# Altium schematic sheet BFMC_Actuators.SchDoc
size A; SheetNumber: 7; SheetTotal: 7
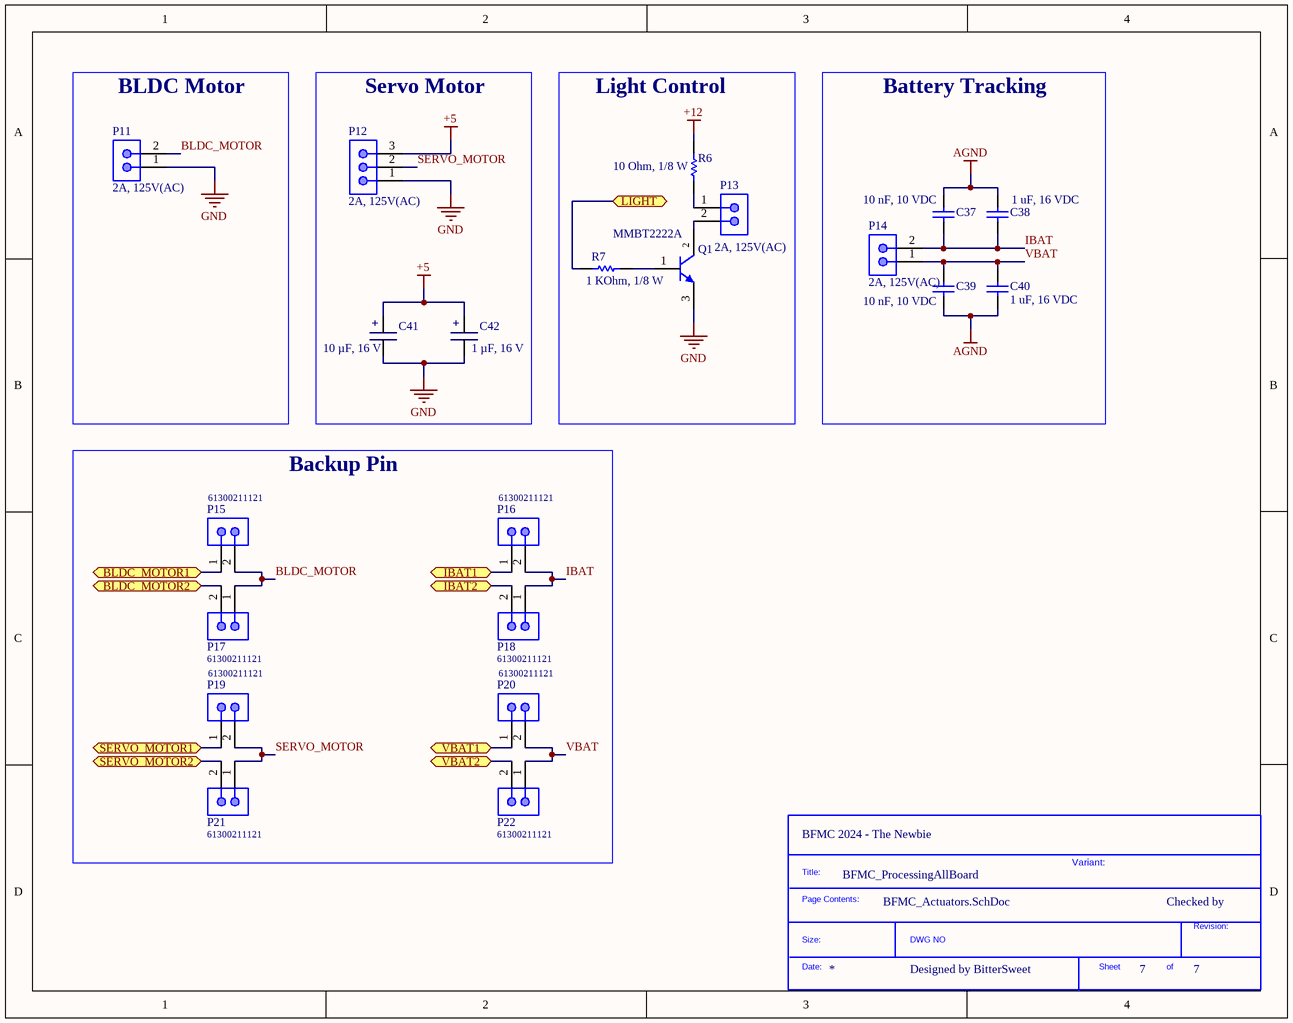
[diagram p0: BFMC_Actuators.SchDoc]

## Parts
*?  SDTitleBlock  (value not drawn)  (graphical)
C37  10 nF, 10 VDC  [CAP_0603]
C38  1 uF, 16 VDC  [CAP_0603]
C39  10 nF, 10 VDC  [CAP_0603]
C40  1 uF, 16 VDC  [CAP_0603]
C41  10 µF, 16 V  [TANTALUM SMD A]
C42  1 µF, 16 V  [TANTALUM SMD A]
P11  2A, 125V(AC)  [620102131822]
P12  2A, 125V(AC)  [620103131822]
P13  2A, 125V(AC)  [620302124022]
P14  2A, 125V(AC)  [620102131822]
P15  61300211121  [61300211121]
P16  61300211121  [61300211121]
P17  61300211121  [61300211121]
P18  61300211121  [61300211121]
P19  61300211121  [61300211121]
P20  61300211121  [61300211121]
P21  61300211121  [61300211121]
P22  61300211121  [61300211121]
Q1  MMBT2222A  [MMBT-SOT23]
R6  10 Ohm, 1/8 W  [RESISTOR_0805]
R7  1 KOhm, 1/8 W  [RESISTOR_0805]

## Blocks framed on the sheet
BLDC Motor: P11
Servo Motor: C41 C42 P12
Light Control: P13 Q1 R6 R7
Battery Tracking: C37-C40 P14
Backup Pin: P15-P22

## Ports
BLDC_MOTOR1 (bidir), BLDC_MOTOR2 (bidir), IBAT1 (bidir), IBAT2 (bidir), LIGHT (bidir), SERVO_MOTOR1 (bidir), SERVO_MOTOR2 (bidir), VBAT1 (bidir), VBAT2 (bidir)

## Nets
+5: C41.2 C42.2 P12.3
+12: R6.2
AGND: C37.2 C38.2 C39.1 C40.1
GND: C41.1 C42.1 P11.1 P12.1 Q1.3(E)
BLDC_MOTOR: P11.2 P15.2 P17.1
BLDC_MOTOR1: P15.1 ; port BLDC_MOTOR1
BLDC_MOTOR2: P17.2 ; port BLDC_MOTOR2
IBAT: C37.1 C38.1 P14.2 P16.2 P18.1
IBAT1: P16.1 ; port IBAT1
IBAT2: P18.2 ; port IBAT2
LIGHT: R7.1 ; port LIGHT
SERVO_MOTOR: P12.2 P19.2 P21.1
SERVO_MOTOR1: P19.1 ; port SERVO_MOTOR1
SERVO_MOTOR2: P21.2 ; port SERVO_MOTOR2
VBAT: C39.2 C40.2 P14.1 P20.2 P22.1
VBAT1: P20.1 ; port VBAT1
VBAT2: P22.2 ; port VBAT2
NetP13_1: P13.1 R6.1
NetP13_2: P13.2 Q1.2(C)
NetQ1_1: Q1.1(B) R7.2

## Notes on the sheet
- (near *?) BFMC 2024 - The Newbie
- BFMC_ProcessingAllBoard
- Variant:
- Checked by
- Designed by BitterSweet
- (in symbol 01120610510) +
- (in symbol 01120610610) +
- (in symbol SDTitleBlock) Title:; Page Contents:; Revision:; Size:; DWG NO; Date:; Sheet; of

## Library data of the parts
C37 C39 = 0106031061010: CAP, size 0603, 10 nF, 10 VDC; Manufacture Name: Samsung Electro-Mechanics; Manufacture SN: CL10A106KP8NNWC; Capacitance: 10 nF; Tolerance: +/-10%; Voltage Rating DC: 10 VDC; ComponentLink2Description: Datasheet; ComponentLink2URL: https://www.mouser.vn/datasheet/2/585/MLCC-1837944.pdf; Operating Temperature: -55 to +125degC; Packaging: Tape and Reel; Mounting Technology: SMT; Size: 0603; Supplier 1 Name: Mouser; Supplier 1 SN: 187-CL10A106KP8NNWC; Supplier 1 URL: https://www.mouser.vn/ProductDetail/Samsung-Electro-Mechanics/CL10A106KP8NNWC?qs=xZ%2FP%252Ba9zWqZx8LSX23YqWA%3D%3D&utm_source=mouser-refine-download&utm_medium=file&utm_campaign=CL10A106KP8NNWC&utm_content=Samsung-Electro-Mechanics; Supplier 2 Name: Digi-Key; Supplier 2 SN: 1276-CL10A106KP8NNWCTR-ND; Supplier 2 URL: https://www.digikey.com/en/products/detail/samsung-electro-mechanics/cl10a106kp8nnwc/16572907; Supplier 3 Name: thegioiic; Supplier 3 SN: N/A; Supplier 3 URL: https://www.thegioiic.com/tu-gom-0603-10uf-25v; Value: 10 nF, 10 VDC; ComponentLink3Description: JLCPCB Link; ComponentLink3URL: https://jlcpcb.com/partdetail/Walsin_TechCorp-0603X106K100/C90806; JLCPCB Part: C90806
C38 C40 = 0106031051016: CAP, size 0603, 1 uF, 16 VDC; Manufacture Name: Samsung Electro-Mechanics; Manufacture SN: CL10B105KO8NNWC; Capacitance: 1 uF; Tolerance: +/-10%; Voltage Rating DC: 16 VDC; ComponentLink2Description: Datasheet; ComponentLink2URL: https://www.mouser.vn/datasheet/2/585/Samsung_MLCC_1837944-1929650.pdf; Operating Temperature: -55 to +125degC; Packaging: Tape and Reel; Mounting Technology: SMT; Size: 0603; Supplier 1 Name: Mouser; Supplier 1 SN: 187-CL10B105KO8NNWC; Supplier 1 URL: https://www.mouser.vn/ProductDetail/Samsung-Electro-Mechanics/CL10B105KO8NNWC?qs=81r%252BiQLm7BT%252BXtc72qn1ug%3D%3D&utm_source=mouser-refine-download&utm_medium=file&utm_campaign=CL10B105KO8NNWC&utm_content=Samsung-Electro-Mechanics; Supplier 2 Name: Digi-Key; Supplier 2 SN: 1276-CL10B105KO8NNWCTR-ND; Supplier 2 URL: https://www.digikey.com/en/products/detail/samsung-electro-mechanics/cl10b105ko8nnwc/16572783; Supplier 3 Name: thegioiic; Supplier 3 SN: N/A; Supplier 3 URL: https://www.thegioiic.com/tu-gom-0603-1uf-16v; Value: 1 uF, 16 VDC
C41 = 01120610610: CAP TANT 10uF 10% 16V 1206; Manufacture  Name: KYOCERA AVX; Manufacture  SN: TPSA106K016R1000; Capacitance Tolerance: +/-10%; ComponentLink1Description: Datasheet link; ComponentLink1URL: https://datasheets.kyocera-avx.com/TAJ.pdf; ComponentLink2Description: Supplier 1 URL; ComponentLink2URL: https://www.mouser.vn/ProductDetail/KYOCERA-AVX/TPSA106K016R1000?qs=GLv2FRWg8zkKT7IxHlCjvQ%3D%3D; Size: 1206; Mounting Technology: SMT; Capacitance: 10uF; ComponentLink3Description: Supplier 2 URL; ComponentLink3URL: https://www.digikey.com/en/products/detail/kyocera-avx/TPSA106K016R1000/7536120; ComponentLink4Description: Supplier 3 URL; ComponentLink4URL: https://www.thegioiic.com/tu-tantalum-10uf-16v-1206-taja106k016rnj; Supplier 1 Name: Mouser; Supplier 1 SN: 581-TPSA106K016R1000; Supplier 1 URL: https://www.mouser.vn/ProductDetail/KYOCERA-AVX/TPSA106K016R1000?qs=GLv2FRWg8zkKT7IxHlCjvQ%3D%3D; Supplier 2 Name: Digi-Key; Supplier 2 SN: 478-10757-1-ND; Supplier 2 URL: https://www.digikey.com/en/products/detail/kyocera-avx/TPSA106K016R1000/7536120; Supplier 3 Name: thegioiic; Supplier 3 SN: N/A; Supplier 3 URL: https://www.thegioiic.com/tu-tantalum-10uf-16v-1206-taja106k016rnj; Value: 10 µF, 16 V; Rated Voltage: 16 V
C42 = 01120610510: CAP TANT 1uF 10% 16V 1206; Manufacture  Name: KYOCERA AVX; Manufacture  SN: TAJA105K016RNJ; Capacitance Tolerance: +/-10%; ComponentLink1Description: Datasheet link; ComponentLink1URL: https://datasheets.kyocera-avx.com/TAJ.pdf; ComponentLink2Description: Supplier 1 URL; ComponentLink2URL: https://www.mouser.vn/ProductDetail/KYOCERA-AVX/TAJA105K016RNJ?qs=OVpPYgiJXXWzOIbDvQCr4Q%3D%3D; Size: 1206; Mounting Technology: SMT; Capacitance: 1uF; ComponentLink3Description: Supplier 2 URL; ComponentLink3URL: https://www.digikey.com/en/products/detail/kyocera-avx/TAJA105K016RNJ/563757; ComponentLink4Description: Supplier 3 URL; ComponentLink4URL: https://www.thegioiic.com/tu-tantalum-1uf-16v-1206-taja105k016rnj; Supplier 1 Name: Mouser; Supplier 1 SN: 581-TAJA105K016; Supplier 1 URL: https://www.mouser.vn/ProductDetail/KYOCERA-AVX/TAJA105K016RNJ?qs=OVpPYgiJXXWzOIbDvQCr4Q%3D%3D; Supplier 2 Name: Digi-Key; Supplier 2 SN: 478-1649-1-ND; Supplier 2 URL: https://www.digikey.com/en/products/detail/kyocera-avx/TAJA105K016RNJ/563757; Supplier 3 Name: thegioiic; Supplier 3 SN: N/A; Supplier 3 URL: https://www.thegioiic.com/tu-tantalum-1uf-16v-1206-taja105k016rnj; Value: 1 µF, 16 V; Rated Voltage: 16 V
P11 P14 = 620102131822: WR-WTB SMT Male Horizontal Shrouded Header, pitch 2mm, 2p; Pin Number: 2; Contact Resistance: 20mOhm; Withstanding Voltage: 800VAC; Working Voltage: 100VAC; ComponentLink1Description: Manufacturer; ComponentLink1URL: http://www.we-online.de; ComponentLink2Description: Datasheet; ComponentLink2URL: https://www.we-online.com/catalog/datasheet/620102131822.pdf; Pitch: 2mm; Published Date: January 2020; Publisher: Wurth Elektronik; Mounting Technology: SMT; Packaging: Tape and Reel; Operating Temperature: -25 to +85degC; Part Number: 620102131822; Gender: Male; Type: Horizontal; Rated Current: 2A; ComponentLink3Description: Global Supply; ComponentLink3URL: https://www.we-online.com/en/components/products/WTB_2_00_SMT_MALE_HORIZONTAL_SHROUDED_HEADER_6201XX131822?sq=620102131822#620102131822; ComponentLink4Description: Global Supply; ComponentLink4URL: https://www.mouser.vn/ProductDetail/Wurth-Elektronik/620102131822?qs=ZtY9WdtwX54K2dkLvxjzuQ%3D%3D; Supplier 1 Name: Mouser; Supplier 1 SN: 710-620102131822; Supplier 1 URL: https://www.mouser.vn/ProductDetail/Wurth-Elektronik/620102131822?qs=ZtY9WdtwX54K2dkLvxjzuQ%3D%3D; Supplier 2 Name: Digi-Key; Supplier 2 SN: N/A; Supplier 2 URL: N/A; Supplier 3 Name: thegioiic; Supplier 3 SN: N/A; Supplier 3 URL: https://www.thegioiic.com/dau-ph2-0mm-2-chan-dan-smd-nam-ngang; Value: 2A, 125V(AC)
P12 = 620103131822: WR-WTB SMT Male Horizontal Shrouded Header, pitch 2mm, 3p; Pin Number: 3; Contact Resistance: 20mOhm; Withstanding Voltage: 800VAC; Working Voltage: 100VAC; ComponentLink1Description: Manufacturer; ComponentLink1URL: http://www.we-online.de; ComponentLink2Description: Datasheet; ComponentLink2URL: https://www.we-online.com/catalog/datasheet/620103131822.pdf; Pitch: 2mm; Published Date: January 2020; Publisher: Wurth Elektronik; Mounting Technology: SMT; Packaging: Tape and Reel; Operating Temperature: -25 to +85degC; Part Number: 620103131822; Gender: Male; Type: Horizontal; Rated Current: 2A; ComponentLink3Description: Global Supply; ComponentLink3URL: https://www.we-online.com/en/components/products/WTB_2_00_SMT_MALE_HORIZONTAL_SHROUDED_HEADER_6201XX131822?sq=620103131822#620103131822; ComponentLink4Description: Global Supply; ComponentLink4URL: https://www.mouser.vn/ProductDetail/Wurth-Elektronik/620103131822?qs=ZtY9WdtwX54jBicvPVEzcw%3D%3D; Supplier 1 Name: Mouser; Supplier 1 SN: 710-620103131822; Supplier 1 URL: https://www.mouser.vn/ProductDetail/Wurth-Elektronik/620103131822?qs=ZtY9WdtwX54jBicvPVEzcw%3D%3D; Supplier 2 Name: Digi-Key; Supplier 2 SN: N/A; Supplier 3 Name: thegioiic; Supplier 3 SN: N/A; Supplier 3 URL: https://www.thegioiic.com/dau-ph2-0mm-3-chan-dan-smd-nam-ngang; Value: 2A, 125V(AC)
P13 = 620302124022: WR-WTB SMT Male Vertical Shrouded Header, pitch 2mm, 2p; Pin Number: 2; Contact Resistance: 20mOhm; Withstanding Voltage: 800VAC; Working Voltage: 100VAC; ComponentLink1Description: Manufacturer; ComponentLink1URL: http://www.we-online.de; ComponentLink2Description: Datasheet; ComponentLink2URL: https://www.we-online.com/catalog/datasheet/620302124022.pdf; Pitch: 2mm; Published Date: January 2020; Publisher: Wurth Elektronik; Mounting Technology: SMT; Packaging: Tape and Reel; Operating Temperature: -25 to +85degC; Part Number: 620302124022; Gender: Male; Type: Vertical; Rated Current: 2A; ComponentLink3Description: Global Supply; ComponentLink3URL: https://www.we-online.com/en/components/products/WTB_2_00_SMT_MALE_VERTICAL_SHROUDED_HEADER_6203XX124022?sq=620302124022#620302124022; ComponentLink4Description: Global Supply; ComponentLink4URL: https://www.mouser.vn/ProductDetail/Wurth-Elektronik/620302124022?qs=ZtY9WdtwX56bKCHoSxh6%252Bg%3D%3D; Supplier 1 Name: Mouser; Supplier 1 SN: 710-620302124022; Supplier 1 URL: https://www.mouser.vn/ProductDetail/Wurth-Elektronik/620302124022?qs=ZtY9WdtwX56bKCHoSxh6%252Bg%3D%3D; Supplier 2 Name: Digi-Key; Supplier 2 SN: N/A; Supplier 2 URL: N/A; Supplier 3 Name: thegioiic; Supplier 3 SN: N/A; Supplier 3 URL: https://www.thegioiic.com/dau-hy2-0mm-2-chan-dan-smd-thang-dung; Value: 2A, 125V(AC)
P15-P22 = 61300211121: WR-PHD Pin Header, THT, pitch 2.54mm, Single Row, Vertical, 2p; Manufacturer: Wurth Elektronik; Pin Number: 2; Rated Current: 3A; Working Voltage: 250VAC; Withstanding Voltage: 500VAC; Contact Resistance: 20mOhm; Supply Name 1: Mouser; ComponentLink1Description: Manufacturer; ComponentLink1URL: http://www.we-online.de; ComponentLink2Description: Datasheet; ComponentLink2URL: https://www.we-online.com/catalog/datasheet/61300211121.pdf; Manufacturer Part Number: 61300211121; Published Date: May 2020; Pitch: 2.54mm; Operating Temperature: -40 to +105degC; Mounting Technology: THT; Packaging: Bag; Gender: Pin Header; Row Number: Single; Orientation: Vertical; ComponentLink3Description: Global Supply; ComponentLink3URL: https://www.mouser.vn/ProductDetail/Wurth-Elektronik/61300211121?qs=t4813l51qx%252B1A5GYDQxPlw%3D%3D; Supplier 1 Name: Mouser; Supplier 1 SN: 710-61300211121; Supplier 1 URL: https://www.mouser.vn/ProductDetail/Wurth-Elektronik/61300211121?qs=t4813l51qx%252B1A5GYDQxPlw%3D%3D; Supplier 2 Name: Digi-Key; Supplier 2 SN: N/A; Supplier 2 URL: N/A; Supplier 3 Name: thegioiic; Supplier 3 SN: N/A; Supplier 3 URL: N/A
Q1 = MMBT2222A: TRANS NPN, 40V, 600MA, SOT23-3; DC Current Gain: 35-300; Gain Bandwidth Product fT: 250MHz; Power Dissipation: 250mW; Current - Collector: 600mA; Package: SOT-23; Supplier 1 Name: Mouser; Supplier 1 SN: 637-MMBT2222A; Supplier 1 URL: https://www.mouser.vn/ProductDetail/Diotec-Semiconductor/MMBT2222A?qs=OlC7AqGiEDl9N1c3%252BL%2F%252Brw%3D%3D; Supplier 2 Name: Digi-Key; Supplier 2 SN: 2796-MMBT2222ATR-ND; Supplier 2 URL: https://www.digikey.com/en/products/detail/diotec-semiconductor/MMBT2222A/13163394; Supplier 3 Name: thegioiic; Supplier 3 URL: https://www.thegioiic.com/mmbt2222a-transistor-npn-40v-0-6a-3-chan-sot-23; Transistor Type: NPN; Voltage - Collector Emitter Breakdown: 40V; Supplier 3 SN: N/A; Value: MMBT2222A
R6 = 0008051001: RES, size 0805, 10 Ohm, 1/8 W; Manufacture  Name: Vishay Dale Thin Film; Manufacture  SN: M55342H06B10D0RT5; Resistance tolerance: +/-1%; Rated Power: 1/8 W; Resistance: 10 Ohm; Size: 0805; Mounting Technology: SMT; Supplier 1 Name: Mouser; Supplier 1 SN: 71-CRCW080510R0FKEAH; Supplier 1 URL: https://www.mouser.vn/ProductDetail/Vishay-Dale/CRCW080510R0FKEAHP?qs=sGAEpiMZZMtlubZbdhIBIB2QTI7Ai3Wq221SUXRDybo%3D; Supplier 2 Name: Digi-Key; Supplier 2 SN: 764-M55342H06B10D0RT5TR-ND; Supplier 2 URL: https://www.digikey.com/en/products/detail/vishay-dale-thin-film/M55342H06B10D0RT5/3580812; Supplier 3 Name: Thegioiic; Supplier 3 SN: N/A; Supplier 3 URL: https://www.thegioiic.com/dien-tro-10-ohm-0805-1-; Value: 10 Ohm, 1/8 W; ComponentLink1Description: Datasheet link; ComponentLink1URL: https://www.vishay.com/docs/60018/eh.pdf; ComponentLink2Description: Supplier 1 URL; ComponentLink2URL: https://www.mouser.vn/ProductDetail/Vishay-Dale/CRCW080510R0FKEAHP?qs=sGAEpiMZZMtlubZbdhIBIB2QTI7Ai3Wq221SUXRDybo%3D; ComponentLink3Description: Supplier 2 URL; ComponentLink3URL: https://www.digikey.com/en/products/detail/vishay-dale-thin-film/M55342H06B10D0RT5/3580812; ComponentLink4Description: Supplier 3 URL; ComponentLink4URL: https://www.thegioiic.com/dien-tro-10-ohm-0805-1-
R7 = 0008051025: RES, size 0805, 1 KOhm, 1/8 W; Manufacture  Name: Vishay Dale; Manufacture  SN: CRCW08051K00JNEAC; Resistance tolerance: +/-5%; Rated Power: 1/8 W; Resistance: 1 KOhm; Size: 0805; Mounting Technology: SMT; Supplier 1 Name: Mouser; Supplier 1 SN: 71-CRCW08051K00JNEC; Supplier 1 URL: https://www.mouser.vn/ProductDetail/Vishay-Dale/CRCW08051K00JNEC?qs=OW6ROCK%252BaiZqKFsNe9zjFw%3D%3D; Supplier 2 Name: Digi-Key; Supplier 2 SN: 541-4162-2-ND; Supplier 2 URL: https://www.digikey.com/en/products/detail/vishay-dale/CRCW08051K00JNEAC/7928584; Supplier 3 Name: Thegioiic; Supplier 3 SN: N/A; Supplier 3 URL: https://www.thegioiic.com/dien-tro-1-kohm-0805-5-; Value: 1 KOhm, 1/8 W; ComponentLink1Description: Datasheet link; ComponentLink1URL: https://www.vishay.com/docs/28773/crcwce3.pdf; ComponentLink2Description: Supplier 1 URL; ComponentLink2URL: https://www.mouser.vn/ProductDetail/Vishay-Dale/CRCW08051K00JNEC?qs=OW6ROCK%252BaiZqKFsNe9zjFw%3D%3D; ComponentLink3Description: Supplier 2 URL; ComponentLink3URL: https://www.digikey.com/en/products/detail/vishay-dale/CRCW08051K00JNEAC/7928584; ComponentLink4Description: Supplier 3 URL; ComponentLink4URL: https://www.thegioiic.com/dien-tro-1-kohm-0805-5-